# EAGLE design design (EAGLE 9.5.2)
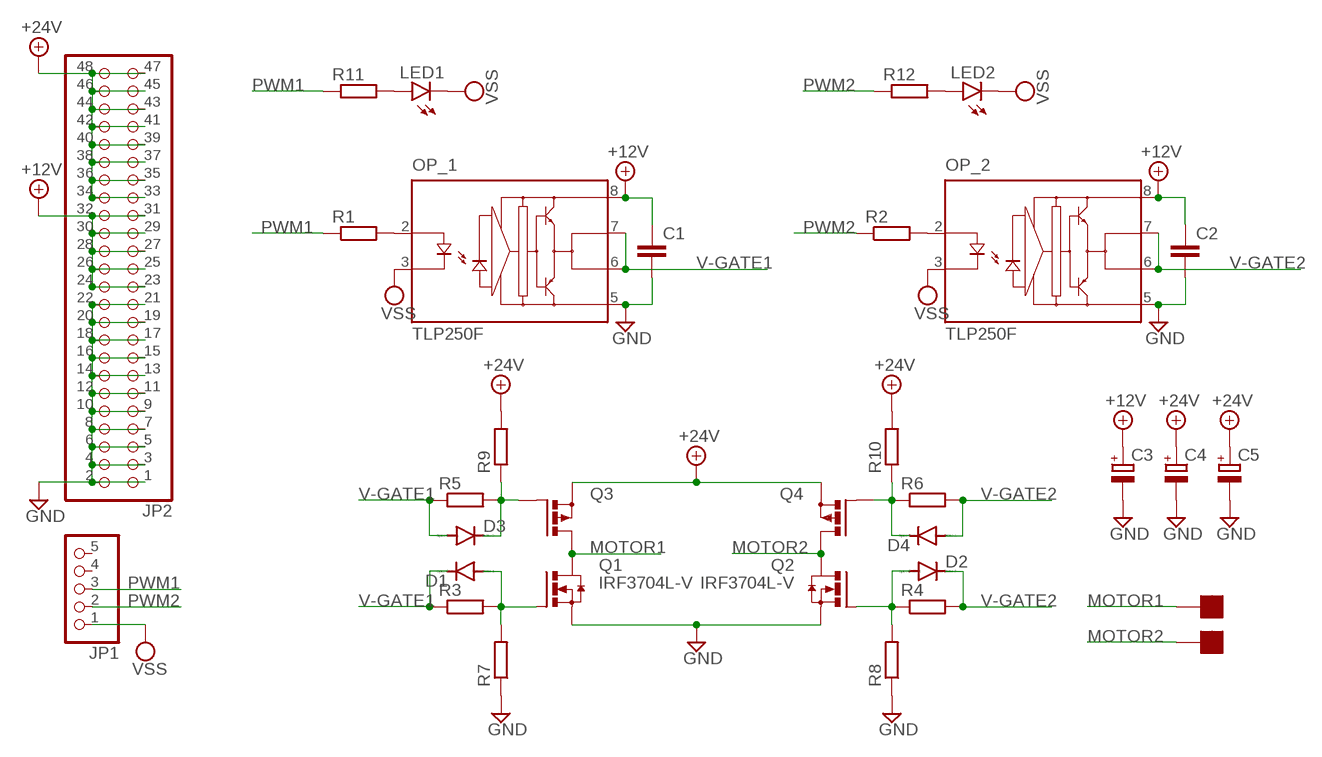
[diagram p0: schematic, sheet 1]

## Parts
C1  C-EUC2012  [C2012]
C2  C-EUC2012  [C2012]
C3  CPOL-EUE5-13  [E5-13]
C4  CPOL-EUE5-13  [E5-13]
C5  CPOL-EUE5-13  [E5-13]
D1  DIODE-SOD110-W  [SOD110-W]
D2  DIODE-SOD110-W  [SOD110-W]
D3  DIODE-SOD110-W  [SOD110-W]
D4  DIODE-SOD110-W  [SOD110-W]
JP1  PINHD-1X5/90  [1X05/90]
JP2  PINHD-2X24/90  [2X24/90]
LED1  LED5MM  [LED5MM]
LED2  LED5MM  [LED5MM]
OP_1  TLP250F  [DIL08]
OP_2  TLP250F  [DIL08]
Q1  IRF3704L-V  [TO262-V]
Q2  IRF3704L-V  [TO262-V]
Q3  PMOSFET_PTO220BV  [TO220BV]
Q4  PMOSFET_PTO220BV  [TO220BV]
R1  R-EU_M0805  [M0805]
R2  R-EU_M0805  [M0805]
R3  R-EU_M0805  [M0805]
R4  R-EU_M0805  [M0805]
R5  R-EU_M0805  [M0805]
R6  R-EU_M0805  [M0805]
R7  R-EU_M0805  [M0805]
R8  R-EU_M0805  [M0805]
R9  R-EU_M0805  [M0805]
R10  R-EU_M0805  [M0805]
R11  R-EU_M0805  [M0805]
R12  R-EU_M0805  [M0805]
U$1  PLAT10.0X10.0  [PLAT]
U$2  PLAT10.0X10.0  [PLAT]

## Nets
+12V: C1.1 C2.1 C3.+ JP2.23 JP2.24 JP2.25 JP2.26 JP2.27 JP2.28 JP2.29 JP2.30 JP2.31 JP2.32 OP_1.8(VCC) OP_2.8(VCC)
+24V: C4.+ C5.+ JP2.33 JP2.34 JP2.35 JP2.36 JP2.37 JP2.38 JP2.39 JP2.40 JP2.41 JP2.42 JP2.43 JP2.44 JP2.45 JP2.46 JP2.47 JP2.48 Q3.S Q4.S R9.2 R10.2
GND: C1.2 C2.2 C3.- C4.- C5.- JP2.1 JP2.2 JP2.3 JP2.4 JP2.5 JP2.6 JP2.7 JP2.8 JP2.9 JP2.10 JP2.11 JP2.12 JP2.13 JP2.14 JP2.15 JP2.16 JP2.17 JP2.18 JP2.19 JP2.20 JP2.21 JP2.22 OP_1.5(GND) OP_2.5(GND) Q1.3(S) Q2.3(S) R7.1 R8.1
MOTOR1: Q1.2(D) Q3.D U$2.P$1(RE)
MOTOR2: Q2.2(D) Q4.D U$1.P$1(RE)
N$1: D1.A Q1.1(G) R3.2 R7.2
N$2: D3.C Q3.G R5.2 R9.1
N$3: OP_1.2(A) R1.2
N$4: OP_2.2(A) R2.2
N$5: D4.C Q4.G R6.1 R10.1
N$6: D2.A Q2.1(G) R4.1 R8.2
N$9: LED1.A R11.2
N$10: LED2.A R12.2
PWM1: JP1.3 R1.1 R11.1
PWM2: JP1.2 R2.1 R12.1
V-GATE1: D1.C D3.A OP_1.6(VO) OP_1.7(VO') R3.1 R5.1
V-GATE2: D2.C D4.A OP_2.6(VO) OP_2.7(VO') R4.2 R6.2
VSS: JP1.1 LED1.K(C) LED2.K(C) OP_1.3(K) OP_2.3(K)
Unconnected: JP1.4 JP1.5

## Library data of the parts
C1 C2 = rcl:C-EU: CAPACITOR, European symbol; SPICEPREFIX: C
C3-C5 = rcl:CPOL-EU: POLARIZED CAPACITOR, European symbol; SPICEPREFIX: C
D1-D4 = diode:DIODE-: DIODE
JP1 = pinhead:PINHD-1X5: PIN HEADER
JP2 = pinhead:PINHD-2X24: PIN HEADER
LED1 LED2 = led:LED: LED OSRAM: - CHIPLED LG R971, LG N971, LY N971, LG Q971, LY Q971, LO R971, LY R971 LH N974, LH R974 LS Q976, LO Q976, LY Q976 LO Q996 - Hyper CHIPLED LW Q18S LB Q993, LB Q99A, LB R99A - SideLED LS A670, LO A670, LY A670, LG A670, LP A670 LB A673, LV A673, LT A673, LW A673 LH A674 LY A675 LS A676, LA A676, LO A676, LY A676, LW A676 LS A679, LY A679, LG A679 - Hyper Micro SIDELED® LS Y876, LA Y876, LO Y876, LY Y876 LT Y87S - SmartLED LW L88C, LW L88S LB L89C, LB L89S, LG L890 LS L89K, LO L89K, LY L89K LS L896, LA L896, LO L896, LY L896 - TOPLED LS T670, LO T670, LY T670, LG T670, LP T670 LSG T670, LSP T670, LSY T670, LOP T670, LYG T670 LG T671, LOG T671, LSG T671 LB T673, LV T673, LT T673, LW T673 LH T674 LS T676, LA T676, LO T676, LY T676, LB T676, LH T676, LSB T676, LW T676 LB T67C, LV T67C, LT T67C, LS T67K, LO T67K, LY T67K, LW E67C LS E67B, LA E67B, LO E67B, LY E67B, LB E67C, LV E67C, LT E67C LW T67C LS T679, LY T679, LG T679 LS T770, LO T770, LY T770, LG T770, LP T770 LB T773, LV T773, LT T773, LW T773 LH T774 LS E675, LA E675, LY E675, LS T675 LS T776, LA T776, LO T776, LY T776, LB T776 LHGB T686 LT T68C, LB T68C - Hyper Mini TOPLED® LB M676 - Mini TOPLED Santana® LG M470 LS M47K, LO M47K, LY M47K Source: http://www.osram.convergy.de LUXEON: - LUMILED® LXK2-PW12-R00, LXK2-PW12-S00, LXK2-PW14-U00, LXK2-PW14-V00 LXK2-PM12-R00, LXK2-PM12-S00, LXK2-PM14-U00 LXK2-PE12-Q00, LXK2-PE12-R00, LXK2-PE12-S00, LXK2-PE14-T00, LXK2-PE14-U00 LXK2-PB12-K00, LXK2-PB12-L00, LXK2-PB12-M00, LXK2-PB14-N00, LXK2-PB14-P00, LXK2-PB14-Q00 LXK2-PR12-L00, LXK2-PR12-M00, LXK2-PR14-Q00, LXK2-PR14-R00 LXK2-PD12-Q00, LXK2-PD12-R00, LXK2-PD12-S00 LXK2-PH12-R00, LXK2-PH12-S00 LXK2-PL12-P00, LXK2-PL12-Q00, LXK2-PL12-R00 Source: www.luxeon.com KINGBRIGHT: KA-3528ASYC Source: www.kingbright.com
OP_1 OP_2 = optocoupler-3-jcn:TLP250F: Toshiba Transistor Inverter Inverter For Air Conditionor IGBT Gate Drive Power MOS FET Gate Drive
Q1 Q2 = transistor-power:IRF3704: SMPS MOSFET HEXFET® Power MOSFET Source: http://www.irf.com/product-info/datasheets/data/irf3704.pdf
Q3 Q4 = transistor-power:PMOSFET_P: Power MOSFET P-Channel
R1-R12 = rcl:R-EU_: RESISTOR, European symbol; SPICEPREFIX: R
U$1 U$2 = plat10-10:PLAT10.0X10.0

## Board
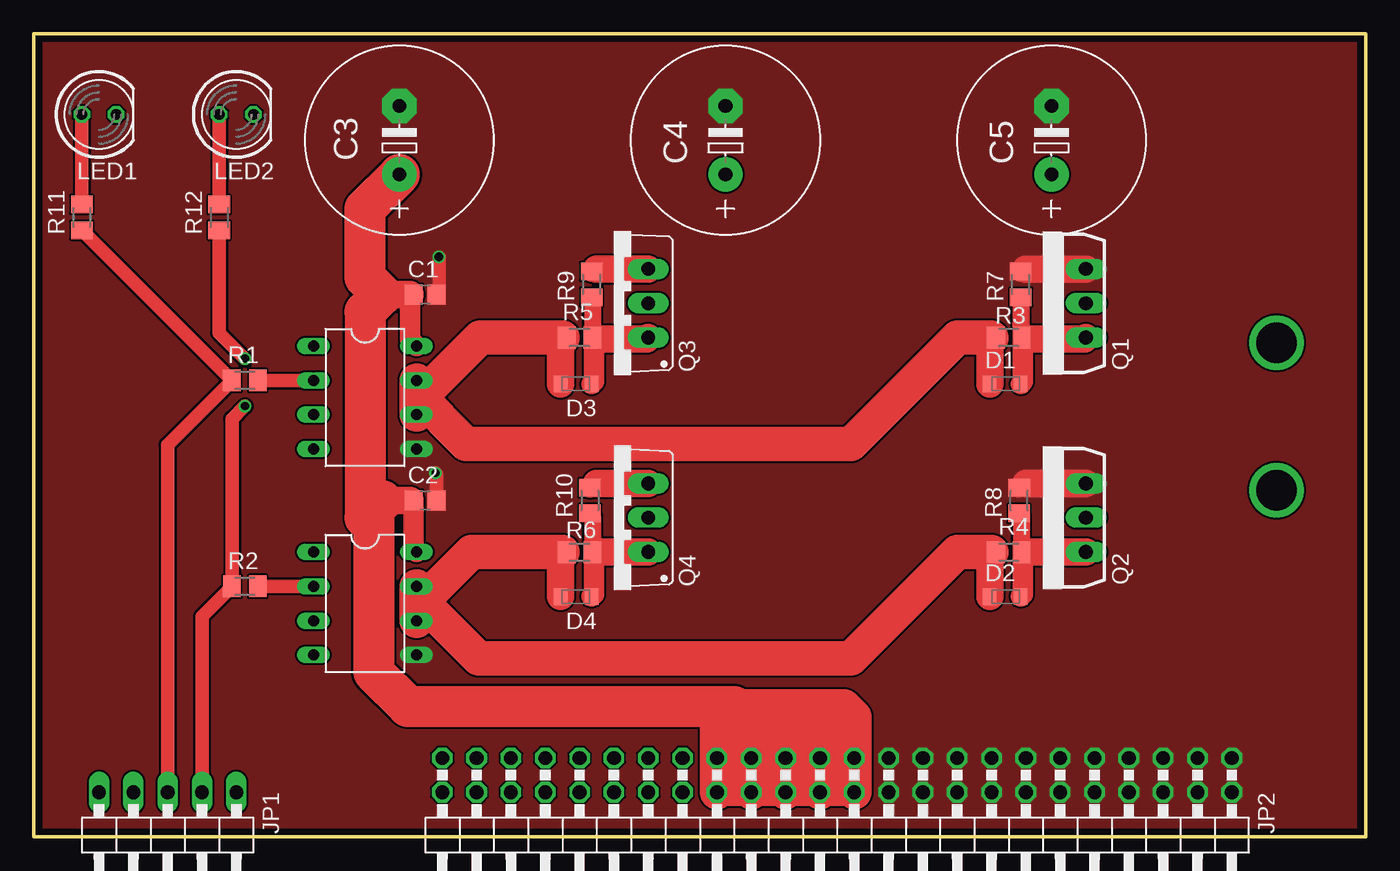
[diagram p1: board, top side]
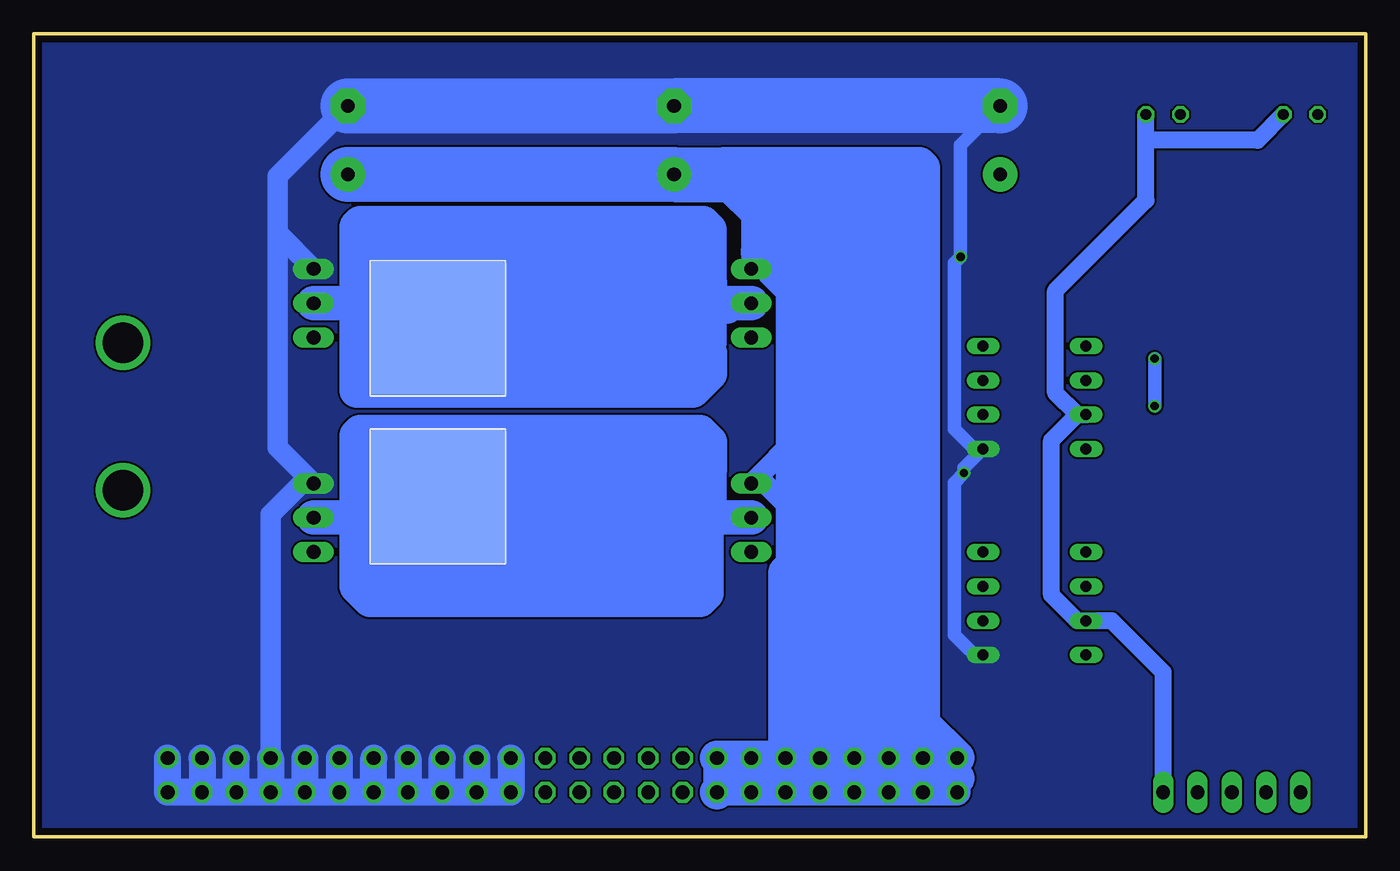
[diagram p2: board, bottom side, seen from below]

Size 98.55 x 59.44 mm. Coordinates in mm from the lower left corner, seen from the top.
Outline: 0,0 98.55,0 98.55,59.44 0,59.44 0,0
Copper layers (1*16): Top 0.035mm / dielectric 1.6mm / Bottom 0.035mm
Design rules "Elecrow_2-layer_PCB_eagle_rule": minimum track width 6mil, minimum drill 12mil, track to track 6mil, track to pad 6mil, pad to pad 6mil, via to via 8mil, smd to smd 0mil, copper to edge 20mil, drill to drill 10mil, minimum pad ring 6mil, minimum via ring 6mil, stop-mask expansion 0mil, vias tented up to drill 100mil, thermal gap 10mil

### Footprints (pad centres in the part's own frame; a part is rotated, then mirrored left to right if it is on the bottom)
C2012 = smd 1.3 x 1.5: 1 -0.85,0; 2 0.85,0
E5-13 = drill 1.016 pad 2.54: + -2.54,0 | drill 1.016 pad 2.54 octagon: - 2.54,0
SOD110-W = smd 1 x 1.2: A 1.15,0; C -1.15,0
1X05/90 = drill 1.016 long: 1 -5.08,-3.81; 2 -2.54,-3.81; 3 0,-3.81; 4 2.54,-3.81; 5 5.08,-3.81
2X24/90 = drill 1.016 octagon: 1 -29.21,-6.35; 2 -29.21,-3.81; 3 -26.67,-6.35; 4 -26.67,-3.81; 5 -24.13,-6.35; 6 -24.13,-3.81; 7 -21.59,-6.35; 8 -21.59,-3.81; 9 -19.05,-6.35; 10 -19.05,-3.81; 11 -16.51,-6.35; 12 -16.51,-3.81; 13 -13.97,-6.35; 14 -13.97,-3.81; 15 -11.43,-6.35; 16 -11.43,-3.81; 17 -8.89,-6.35; 18 -8.89,-3.81; 19 -6.35,-6.35; 20 -6.35,-3.81; 21 -3.81,-6.35; 22 -3.81,-3.81; 23 -1.27,-6.35; 24 -1.27,-3.81; 25 1.27,-6.35; 26 1.27,-3.81; 27 3.81,-6.35; 28 3.81,-3.81; 29 6.35,-6.35; 30 6.35,-3.81; 31 8.89,-6.35; 32 8.89,-3.81; 33 11.43,-6.35; 34 11.43,-3.81; 35 13.97,-6.35; 36 13.97,-3.81; 37 16.51,-6.35; 38 16.51,-3.81; 39 19.05,-6.35; 40 19.05,-3.81; 41 21.59,-6.35; 42 21.59,-3.81; 43 24.13,-6.35; 44 24.13,-3.81; 45 26.67,-6.35; 46 26.67,-3.81; 47 29.21,-6.35; 48 29.21,-3.81
LED5MM = drill 0.813 octagon: A -1.27,0; K 1.27,0
DIL08 = drill 0.813 long: 1 -3.81,-3.81; 2 -1.27,-3.81; 3 1.27,-3.81; 4 3.81,-3.81; 5 3.81,3.81; 6 1.27,3.81; 7 -1.27,3.81; 8 -3.81,3.81
TO262-V = drill 1.016 long: 1 -2.54,0; 2 0,0; 3 2.54,0
TO220BV = drill 1.016 long: D 0,-2.54; G -2.54,-2.54; S 2.54,-2.54
M0805 = smd 1.3 x 1.6: 1 -0.95,0; 2 0.95,0
PLAT = smd 10 x 10: P$1 5,5

### Placement (x,y rotation side)
C1  28.96,40.13 0 top
C2  28.96,24.89 0 top
C3  27.05,51.56 90 top
C4  51.18,51.56 90 top
C5  75.31,51.56 90 top
D1  71.88,33.53 0 top
D2  71.88,17.78 0 top
D3  40.13,33.53 180 top
D4  40.13,17.78 180 top
JP1  9.91,-0.51 180 top
JP2  59.44,-0.51 180 top
LED1  4.83,53.47 0 top
LED2  14.99,53.47 0 top
OP_1  24.51,32.51 270 top
OP_2  24.51,17.27 270 top
Q1  77.85,39.5 90 top
Q2  77.85,23.62 90 top
Q3  42.93,39.5 90 top
Q4  42.93,23.62 90 top
R1  15.62,33.78 0 top
R2  15.62,18.54 0 top
R3  72.14,36.96 0 top
R4  72.14,21.08 180 top
R5  40.39,36.96 0 top
R6  40.39,21.08 180 top
R7  73.03,40.89 270 top
R8  72.9,24.89 270 top
R9  41.27,40.89 90 top
R10  41.15,24.89 90 top
R11  3.56,45.85 90 top
R12  13.72,45.85 90 top
U$1  73.66,20.19 0 bottom
U$2  73.66,32.64 0 bottom

### Tracks (layer width: path | path; a pad name or v marks a point on that pad's centre or on a via)
+12V
  Top 1.27: 27.84,40.13 C1.1 | 27.84,24.89 28.09,24.89 C2.1
  Top 1.524: OP_1.8 27.84,36.8 27.84,40.13 | OP_2.8 28.09,21.31 28.09,24.89
  Top 2: JP2.31 JP2.32 JP2.30 | JP2.29 JP2.30 | JP2.30 JP2.28 | JP2.28 JP2.26 | JP2.26 JP2.24 60.71,4.57 JP2.23 | JP2.26 JP2.25 | JP2.28 JP2.27
  Top 2.032: 25.78,40.13 27.84,40.13 | 25.78,24.89 27.84,24.89
  Top 2.54: JP2.31 JP2.29 | JP2.29 JP2.23 | 60.71,4.57 60.45,4.32 51.05,4.32 52.58,5.84 JP2.29 | 55.88,9.65 51.82,9.65 53.09,8.38 JP2.30 | 55.88,9.65 58.17,9.65 | 58.17,9.65 59.94,9.65 60.71,8.89 JP2.24 | JP2.32 50.55,9.4 50.29,9.65 | JP2.26 58.17,9.65 | JP2.28 55.63,8.38 55.88,8.64 55.88,9.65
  Top 3.048: JP2.27 51.82,9.65 50.29,9.65 27.69,9.65 25.15,12.19 25.15,24.26 | 25.15,24.26 24.51,23.62 24.51,38.86 25.78,40.13 24.51,41.4 24.51,46.48 C3.+ | 25.15,24.26 25.78,24.89
+24V
  Top 1.524: R9.2 41.66,42.04 | R10.2 41.66,26.16
  Top 2.032: 41.66,42.04 Q3.S | 41.66,26.16 Q4.S
  Bottom 1.524: Q3.S 44.2,43.31 44.2,41.57 41.81,39.19 41.81,29.81 Q4.S 44.45,26.16 40.39,22.1 JP2.39
  Bottom 2: JP2.46 JP2.48 30.23,4.32 JP2.47 | JP2.46 JP2.44 | JP2.44 JP2.42 | JP2.42 JP2.40 | JP2.40 JP2.38 | JP2.38 JP2.36 | JP2.36 JP2.34 JP2.33 | JP2.36 JP2.35 | JP2.38 JP2.37 | JP2.40 JP2.39 | JP2.42 JP2.41 | JP2.44 JP2.43 | JP2.46 JP2.45
  Bottom 2.54: JP2.33 JP2.47 32.77,8.38 | JP2.34 46.99,4.32 30.23,4.32 | JP2.37 42.93,8.13 | 42.93,8.13 42.93,10.67 | 42.93,10.67 42.93,19.56 42.37,20.12 42.37,40.46 42.42,40.51 42.42,49.78 | 46.74,49.02 47.5,49.78 42.42,49.78 | 42.42,49.78 40.64,49.78 | 40.64,49.78 39.12,49.78 | 39.12,49.78 36.58,49.78 | 36.58,49.78 34.54,49.78 | 34.54,49.78 33.02,49.78 32.77,49.53 32.77,10.67 | 32.77,10.67 32.77,8.38 | JP2.43 32.77,8.38 | 32.77,8.38 42.67,8.38 42.93,8.13 | 42.93,10.67 41.4,10.67 | 41.4,10.67 38.35,10.67 | 38.35,10.67 36.58,10.67 | 36.58,10.67 34.8,10.67 | 34.8,10.67 32.77,10.67 | 34.54,49.78 34.54,10.92 34.8,10.67 | 36.58,10.67 36.58,49.78 | 39.12,49.78 39.12,11.43 38.35,10.67 | 41.4,10.67 41.4,49.02 40.64,49.78
  Bottom 4.064: C5.+ C4.+ 46.74,49.02 44.2,46.48 44.2,43.31
GND  (via drill 0.6)
  Top 1.016: v29.97,42.93 29.97,40.3 C1.2 | v29.72,26.92 29.81,26.84 C2.2
  Top 1.524: R8.1 73.41,26.16 | R7.1 73.41,42.04
  Top 2.032: 73.41,26.16 Q2.3 | 73.41,42.04 Q1.3
  Bottom 1.016: OP_2.5 28.96,13.46 30.45,14.96 30.45,26.19 v29.72,26.92 29.72,27.3 OP_1.5 28.96,28.7 30.45,30.2 30.45,42.45 v29.97,42.93 29.97,51.18 C3.-
  Bottom 1.524: Q1.3 80.52,44.7 | C5.- 80.52,48.9 80.52,44.7 | 80.52,44.7 80.52,28.83 Q2.3 78.74,26.16 81.03,23.88 JP2.7
  Bottom 2: JP2.21 JP2.22 JP2.20 | JP2.20 JP2.18 | JP2.18 JP2.16 | JP2.16 JP2.14 | JP2.14 JP2.12 | JP2.12 JP2.10 | JP2.10 JP2.8 | JP2.8 JP2.6 | JP2.6 JP2.4 | JP2.4 JP2.2 JP2.1 | JP2.3 JP2.4 | JP2.6 JP2.5 | JP2.7 JP2.8 | JP2.10 JP2.9 | JP2.11 JP2.12 | JP2.14 JP2.13 | JP2.15 JP2.16 | JP2.18 JP2.17 | JP2.19 JP2.20
  Bottom 4.064: C3.- C4.- C5.-
  pour Bottom (no thermals): 0,59.44 0,-0.51 98.55,-0.51 98.55,59.44
  pour Top (no thermals): 0,59.44 0,-0.51 98.55,-0.51 98.55,59.44
MOTOR1
  Bottom 2.54: Q3.D 47.24,39.5 | 47.24,39.5 48.51,39.5 | 48.51,39.5 68.58,39.5 | 68.58,39.5 75.44,39.5 | Q1.2 75.44,39.5 | U$2.P$1 68.58,37.72 68.58,39.5 | 75.44,39.5 74.68,38.73 | 47.24,39.24 47.24,39.5 | 48.56,34.24 49.78,33.02 74.68,33.02 74.68,38.73 | 48.51,39.5 48.51,41.02 48.56,41.07 | 48.56,44.96 49.02,45.42 74.42,45.42 74.68,45.17 74.68,42.42 | 48.56,41.07 48.56,42.42 | 48.56,42.42 48.56,44.96 | 74.68,38.73 74.68,42.42 | 49.91,42.42 48.56,42.42 | 48.64,41.15 49.91,42.42 | 49.91,42.42 74.68,42.42 | 48.56,41.07 48.64,41.15 | 48.64,41.15 56.9,41.15 57.4,40.64 64.01,40.64 | 65.28,38.1 65.02,38.35 48.99,38.35 48.56,37.92 48.56,36.58 48.81,36.83 62.48,36.83 64.26,35.05 63.5,34.29 62.23,34.29 61.72,34.8 49.11,34.8 48.56,34.24 | 48.56,34.24 48.51,34.29 48.51,35.81 | 48.56,44.96 50.08,43.43 73.66,43.43 73.91,43.69
MOTOR2
  Bottom 2.54: Q4.D 48.77,23.62 | 68.58,23.62 48.77,23.62 | 68.58,23.62 74.68,23.62 | 74.68,23.62 Q2.2 | U$1.P$1 68.66,23.7 68.58,23.62 | U$1.P$1 68.53,25.19 63.75,29.97 | 63.75,29.97 49.28,29.97 48.51,29.21 48.51,27.17 48.56,27.13 | 48.77,23.62 48.56,23.83 48.56,27.13 | U$1.P$1 73.44,29.97 | 73.44,29.97 74.42,29.97 74.68,29.72 74.68,23.62 | 48.77,23.62 48.77,21.59 | 48.77,21.59 48.77,18.03 49.28,17.53 73.66,17.53 74.68,18.54 74.68,23.62 | 48.56,27.13 49.63,28.19 63.5,28.19 64.01,27.69 64.01,25.65 50.03,25.65 48.56,27.13 | 48.77,21.59 73.66,21.59 74.17,21.08 74.17,20.32 73.15,19.3 49.78,19.3 49.53,19.56 | 73.44,29.97 63.75,29.97
N$1
  Top 1.27: 73.66,36.83 73.53,36.96 73.2,36.96 R3.2 73.07,36.97 73.07,37.87 73.03,37.92 R7.2
  Top 1.524: D1.A 73.2,33.69 73.2,36.96
  Top 2.032: 73.66,36.83 77.72,36.83 Q1.1
N$2
  Top 1.27: 41.91,36.83 41.78,36.96 41.45,36.96 R5.2 41.34,39.88 R9.1
  Top 1.524: D3.C 41.45,33.69 41.45,36.96
  Top 2.032: 41.91,36.83 45.34,36.83 Q3.G
N$3
  Top 1.016: R1.2 OP_1.2
N$4
  Top 1.016: OP_2.2 R2.2
N$5
  Top 1.27: 41.91,21.08 41.45,21.08 R6.1 41.34,23.75 R10.1
  Top 1.524: D4.C 41.45,17.95 41.45,21.08
  Top 2.032: 41.91,21.08 Q4.G
N$6
  Top 1.27: 73.66,21.08 73.2,21.08 R4.1 73.09,23.75 R8.2
  Top 1.524: D2.A 73.2,17.95 73.2,21.08
  Top 2.032: 73.66,21.08 Q2.1
N$7  (via drill 3)
  other vias: 91.95,36.58
N$8  (via drill 3)
  other vias: 91.95,25.65
N$9
  Top 1.016: LED1.A R11.2
N$10
  Top 1.016: LED2.A R12.2
PWM1
  Top 1.016: JP1.3 9.91,29.02 R1.1 R11.1
PWM2  (via drill 0.6)
  Top 1.016: JP1.2 12.45,16.32 R2.1 14.67,30.93 v15.62,31.88 | R12.1 13.72,37.3 v15.62,35.39
  Bottom 1.016: v15.62,35.39 v15.62,31.88
V-GATE1
  Top 1.524: R5.1 39.12,36.96 | R3.1 71.12,36.96 70.87,36.96
  Top 2.032: D3.A 38.98,36.82 39.12,36.96 | D1.C 70.73,36.5 71.12,36.89 71.12,36.96
  Top 2.54: OP_1.7 28.32,32.77 | 28.32,32.77 28.32,32.26 | 28.32,32.26 OP_1.6 | 28.32,32.26 33.02,36.96 39.12,36.96 | 70.87,36.96 68.33,36.96 60.45,29.08 32,29.08 28.32,32.77
V-GATE2
  Top 1.524: R6.2 39.12,21.08 | R4.2 71.12,21.08 70.87,21.08
  Top 2.032: D2.C 70.73,20.63 71.12,21.02 71.12,21.08 | D4.A 38.98,20.95 39.12,21.08
  Top 2.54: OP_2.7 28.32,17.78 | 28.32,17.78 28.32,17.02 | 28.32,17.02 OP_2.6 | 39.12,21.08 32.38,21.08 28.32,17.02 | 70.87,21.08 68.33,21.08 60.45,13.21 32.89,13.21 28.32,17.78
VSS
  Bottom 1.27: JP1.1 14.99,12.19 18.8,16 OP_2.3 21.34,16 23.24,17.91 23.24,29.34 21.34,31.24 | 21.34,31.24 OP_1.3 | 21.34,31.24 22.96,32.86 22.96,40.42 16.26,47.12 16.26,51.56 | 16.26,51.56 LED2.K | LED1.K 8,51.56 16.26,51.56